# EAGLE design 0_96_OLED_FOR_1U (EAGLE 9.5.0)
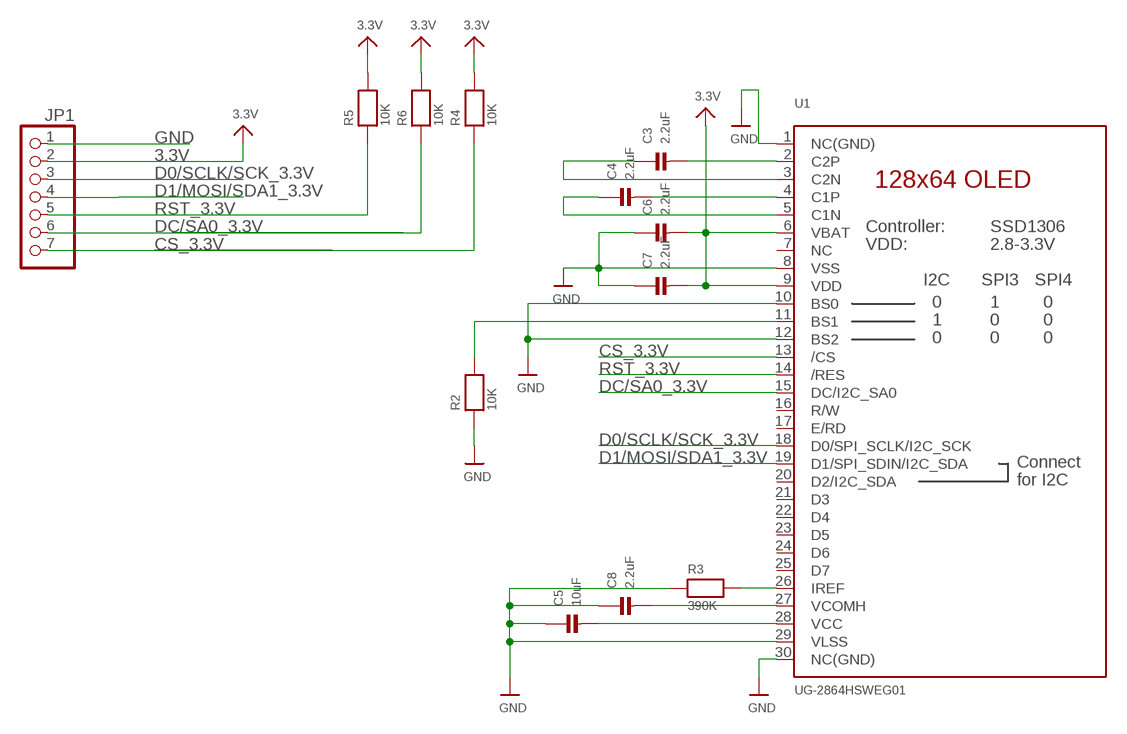
[diagram p0: schematic, sheet 1]

## Parts
C3  2.2uF  CAP_CERAMIC0603MINI  [0603-MINI]
C4  2.2uF  CAP_CERAMIC0603MINI  [0603-MINI]
C5  10uF  CAP_CERAMIC0603MINI  [0603-MINI]
C6  2.2uF  CAP_CERAMIC0603MINI  [0603-MINI]
C7  2.2uF  CAP_CERAMIC0603MINI  [0603-MINI]
C8  2.2uF  CAP_CERAMIC0603MINI  [0603-MINI]
JP1  HEADER-1X7ROUND  [1X07_ROUND]
R2  10K  RESISTOR0603MINI  [0603-MINI]
R3  390K  RESISTOR0603MINI  [0603-MINI]
R4  10K  RESISTOR0603MINI  [0603-MINI]
R5  10K  RESISTOR0603MINI  [0603-MINI]
R6  10K  RESISTOR0603MINI  [0603-MINI]
U1  UG-2864HSWEG01  MICROBUILDER_DISP_OLED_UG-2864HSWEG010.96"  [MICROBUILDER_UG-2864HSWEG01_0.96IN_WRAPAROUND]

## Nets
3.3V: C6.2 C7.2 JP1.2 R4.2 R5.2 R6.2 U1.6(VBAT) U1.9(VDD)
CS_3.3V: JP1.7 R4.1 U1.13(/CS)
D0/SCLK/SCK_3.3V: JP1.3 U1.18(D0/SPI_SCLK/I2C_SCK)
D1/MOSI/SDA1_3.3V: JP1.4 U1.19(D1/SPI_SDIN/I2C_SDA)
DC/SA0_3.3V: JP1.6 R6.1 U1.15(DC/I2C_SA0)
GND: C5.1 C6.1 C7.1 C8.1 JP1.1 R2.1 R3.1 U1.1(NC(GND)) U1.8(VSS) U1.10(BS0) U1.12(BS2) U1.29(VLSS) U1.30(NC(GND))
N$1: R2.2 U1.11(BS1)
N$3: R3.2 U1.26(IREF)
N$4: C3.2 U1.2(C2P)
N$5: C3.1 U1.3(C2N)
N$6: C4.2 U1.4(C1P)
N$7: C4.1 U1.5(C1N)
N$11: C5.2 U1.28(VCC)
N$12: C8.2 U1.27(VCOMH)
RST_3.3V: JP1.5 R5.1 U1.14(/RES)
Unconnected: U1.7(NC) U1.16(R/W) U1.17(E/RD) U1.20(D2/I2C_SDA) U1.21(D3) U1.22(D4) U1.23(D5) U1.24(D6) U1.25(D7)

## Library data of the parts
C3-C8 = microbuilder:CAP_CERAMIC: Ceramic Capacitors 0402 - 0402 Surface Mount Capacitors 16pF 50V 5% [Digikey: 445-4899-2-ND] 18pF 50V 5% [Digikey: 490-1281-2-ND] 22pF 50V 5% [Digikey: 490-1283-2-ND] 68pF 50V 5% [Digikey: 490-1289-2-ND] 0.1uF 10V 10% [Digikey: 490-1318-2-ND] 1.0uF 6.3V 10% [Digikey: 490-1320-2-ND] 0603 - 0603 Surface Mount Capacitors 16 pF 50V 5% [Digikey: 445-5051-2-ND] 22 pF 50V [Digikey: PCC220ACVTR-ND] 33 pF 50V 5% [Digikey: 490-1415-1-ND] 56pF 50V 5% [Digikey: 490-1421-1-ND] 220pF 50V 5% [Digikey: 445-1285-1-ND] 680 pF 50V 2200 pF 50V 5% C0G [Digikey: 445-1297-1-ND] 5600 pF 100V 5% X7R [Digikey: 478-3711-1-ND] 0.1 µF 25V 10% [Digikey: PCC2277TR-ND] 0.22 µF 16V 10% X7R [Digikey: 445-1318-1-ND] 1.0 µF 25V 10% [Digikey: 445-5146-2-ND] 0603 - RF Specific 3pF 250V +/-0.1pF RF [Digikey: 712-1347-1-ND] 18 pF 250V 5% [Digikey: 478-3505-1-ND or 712-1322-1-ND] 56 pF 250V 5% C0G RF [Digikey: 490-4867-1-ND] 68 pF 250V RF [Digikey: 490-4868-1-ND] 0805 - 0805 Surface Mount Capacitors 220 pF 250V 2% RF Ceramic Capacitor [Digikey: 712-1398-1-ND] 1000 pF 50V 2% NP0 Ceramic Capacitor [Digikey: 478-3760-1-ND] 0.1 µF 25V 10% Ceramic Capacitor [Digikey: PCC1828TR-ND] 1.0 µF 16V 10% Ceramic Capacitor[Digikey: 490-1691-2-ND] 10.0 µF 10V 10% Ceramic Capacitor[Digikey: 709-1228-1-ND] 10.0 uF 16V 10% Ceramic Capacitor [Digikey: 478-5165-2-ND] 47 uF 6.3V 20% Ceramic Capacitor [Digikey: 587-1779-1-ND or 399-5506-1-ND] 1206 - 1206 Surface Mount Capacitors 47uF 10V 20% Ceramic Capacitor [Digikey: 490-5528-1-ND or 399-5508-1-ND or 445-6010-1-ND] 100uF 6.3V -20%, +80% Y5V Ceramic Capacitor (Digikey: 490-4512-1-ND, Mouser: 81-GRM31CF50J107ZE1L)
JP1 = microbuilder:HEADER-1X7: PIN HEADER; SPICEPREFIX: X
R2-R6 = microbuilder:RESISTOR: Resistors 0402 - 0402 Surface Mount Package 22 Ohm 1% 1/16W [Digikey: 311-22.0LRTR-ND] 33 Ohm 5% 1/16W 1.0K 5% 1/16W 1.5K 5% 1/16W 2.0K 1% 1/16W 10.0K 1% 1/16W [Digikey: 311-10.0KLRTR-ND] 10.0K 5% 1/16W [Digikey: RMCF0402JT10K0TR-ND] 12.1K 1% 1/16W [Digikey: 311-22.0LRTR-ND] 100.0K 5% 1/16W 0603 - 0603 Surface Mount Package 0 Ohm 1/10 Watt 1% Resistor 15 Ohm 1/10 Watt 1% Resistor 33 Ohm 1/10 Watt 1% Resistor 49.9 Ohm 1/10 Watt 1% Resistor 100 Ohm 1/10 Watt 1% Resistor 150 Ohm 1/10 Watt 1% Resistor 240 Ohm 1/10 Watt 1% Resistor 390 Ohm 1/10 Watt 1% Resistor 560 Ohm 1/10 Watt 1% Resistor 680 Ohm 1/10 Watt 1% Resistor 750 Ohm 1/10 Watt 1% Resistor 1.0K Ohm 1/10 Watt 1% Resistor 1.5K Ohm 1/10 Watt 1% Resistor 2.0K Ohm 1/10 Watt 1% Resistor 2.2K Ohm 1/10 Watt 1% Resistor 3.3K Ohm 1/10 Watt 1% Resistor 4.7K Ohm 1/10 Watt 1% Resistor 10.0K Ohm 1/10 Watt 1% Resistor 12.0K Ohm 1/10 Watt 1% Resistor 12.1K Ohm 1/10 Watt 1% Resistor 20.0K Ohm 1/10 Watt 1% Resistor 33.0K Ohm 1/10 Watt 1% Resistor 100.0K Ohm 1/10 Watt 1% Resistor 0805 - 0805 Surface Mount Package 0 Ohm 1/8 Watt 1% Resistor 33 Ohm 1/8 Watt 1% Resistor 100 Ohm 1/8 Watt 1% Resistor 150 Ohm 1/8 Watt 1% Resistor 200 Ohm 1/8 Watt 1% Resistor 240 Ohm 1/8 Watt 1% Resistor 330 Ohm 1/8 Watt 1% Resistor 390 Ohm 1/8 Watt 1% Resistor 470 Ohm 1/8 Watt 1% Resistor 1.0K Ohm 1/8 Watt 1% Resistor 1.5K Ohm 1/8 Watt 1% Resistor 2.0K Ohm 1/8 Watt 1% Resistor 4.7K Ohm 1/8 Watt 1% Resistor 5.1K Ohm 1/8 Watt 1% Resistor 5.6K Ohm 1/8 Watt 1% Resistor 10.0K Ohm 1/8 Watt 1% Resistor 22.0K Ohm 1/8 Watt 1% Resistor 33.0K Ohm 1/8 Watt 1% Resistor 100K Ohm 1/8 Watt 1% Resistor 1206 - 1206 Surface Mount Package 2012 - 2010 Surface Mount Package 0.11 Ohm 1/2 Watt 1% Resistor - Digikey: RHM.11UCT-ND
U1 = 0_96_OLED_FOR_1U:MICROBUILDER_DISP_OLED_UG-2864HSWEG01: UG-2864HSWEG01 OLED display Both 1.3" and 0.96" models share the same FPC tab footprint, only the screen dimensions vary.

## Board
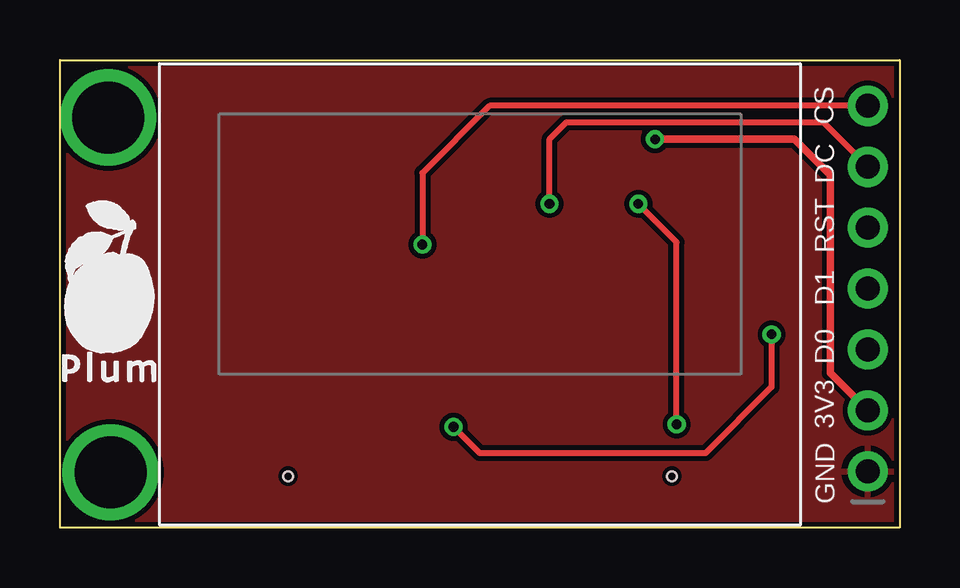
[diagram p1: board, top side]
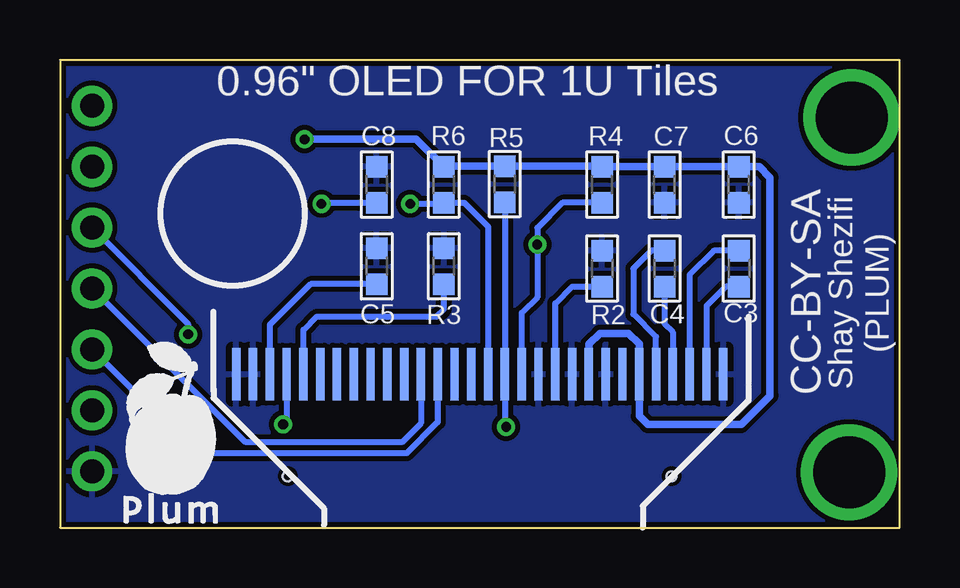
[diagram p2: board, bottom side, seen from below]

Size 35 x 19.5 mm. Coordinates in mm from the lower left corner, seen from the top.
Outline: 0,0 0,19.5 35,19.5 35,0 0,0
Copper layers (1*16): Top 0.0356mm / dielectric 1.5011mm / Bottom 0.0356mm
Design rules "LaenPCBOrder *": minimum track width 6mil, minimum drill 13mil, track to track 8mil, track to pad 8mil, pad to pad 8mil, via to via 8mil, smd to smd 8mil, copper to edge 8mil, drill to drill 8mil, minimum pad ring 7mil, minimum via ring 7mil, stop-mask expansion 3mil, vias tented up to drill 25mil, thermal gap 10mil

### Footprints (pad centres in the part's own frame; a part is rotated, then mirrored left to right if it is on the bottom)
0603-MINI = smd 0.9 x 0.9: 1 -0.75,0; 2 0.75,0
1X07_ROUND = drill 1 pad 1.676: 1 -7.62,0; 2 -5.08,0; 3 -2.54,0; 4 0,0; 5 2.54,0; 6 5.08,0; 7 7.62,0
MICROBUILDER_UG-2864HSWEG01_0.96IN_WRAPAROUND = smd 0.35 x 2.2 bottom: 1 -10.15,-1.2; 2 -9.45,-1.2; 3 -8.75,-1.2; 4 -8.05,-1.2; 5 -7.35,-1.2; 6 -6.65,-1.2; 7 -5.95,-1.2; 8 -5.25,-1.2; 9 -4.55,-1.2; 10 -3.85,-1.2; 11 -3.15,-1.2; 12 -2.45,-1.2; 13 -1.75,-1.2; 14 -1.05,-1.2; 15 -0.35,-1.2; 16 0.35,-1.2; 17 1.05,-1.2; 18 1.75,-1.2; 19 2.45,-1.2; 20 3.15,-1.2; 21 3.85,-1.2; 22 4.55,-1.2; 23 5.25,-1.2; 24 5.95,-1.2; 25 6.65,-1.2; 26 7.35,-1.2; 27 8.05,-1.2; 28 8.75,-1.2; 29 9.45,-1.2; 30 10.15,-1.2 | hole 0.4: -8,-5.45; 8,-5.45

### Placement (x,y rotation side)
C3  6.7,10.8 270 bottom
C4  9.8,10.8 270 bottom
C5  21.8,10.9 270 bottom
C6  6.7,14.3 90 bottom
C7  9.8,14.3 90 bottom
C8  21.8,14.3 270 bottom
JP1  33.67,9.97 90 top
R2  12.4,10.8 270 bottom
R3  19,10.9 270 bottom
R4  12.4,14.3 90 bottom
R5  16.46,14.32 90 bottom
R6  19,14.3 90 bottom
U1  17.5,7.59 0 top

### Tracks (layer width: path | path; a pad name or v marks a point on that pad's centre or on a via)
3.3V  (via drill 0.4)
  Top 0.305: v24.8,16.19 30.61,16.19 32.1,14.7 32.1,6.45 JP1.2
  Bottom 0.305: U1.9 12.95,7.65 12.5,8.1 11.3,8.1 10.85,7.65 U1.6 10.85,4.65 10.5,4.3 6.6,4.3 5.4,5.5 5.4,14.6 5.85,15.05 C6.2 C7.2 R4.2 12.42,15.07 R5.2 18.98,15.07 R6.2 20.15,16.2 v24.79,16.2 v24.8,16.19
CS_3.3V  (via drill 0.4)
  Top 0.254: JP1.7 17.9,17.59 15.1,14.79 v15.1,11.8
  Bottom 0.254: U1.13 15.75,8.95 15.1,9.6 v15.1,11.8 15.1,12.5 14.05,13.55 R4.1
D0/SCLK/SCK_3.3V
  Bottom 0.254: JP1.3 29.34,3.1 20.55,3.1 19.25,4.4 U1.18
D1/MOSI/SDA1_3.3V
  Bottom 0.254: JP1.4 27.26,3.56 20.74,3.56 19.95,4.35 U1.19 20,6.34
DC/SA0_3.3V  (via drill 0.4)
  Top 0.254: JP1.6 31.81,16.9 21.1,16.9 20.4,16.2 v20.4,13.5
  Bottom 0.254: v20.4,13.5 19.1,13.5 19.05,13.55 R6.1 18.15,13.55 17.15,12.55 U1.15
GND
  pour Top: 35,19.5 0,19.5 0,0 35,0
  pour Bottom: 35,19.5 0,19.5 0,0 35,0
N$1
  Bottom 0.254: U1.11 14.35,8.1 | 14.35,8.1 | R2.2 13.65,10.05 14.35,9.35 14.35,8.1
N$2  (via drill 3)
  other vias: 2.1,2.3
N$3
  Bottom 0.254: R3.2 19,9.1 19.3,8.8 24.3,8.8 24.85,8.25 U1.26
N$4
  Bottom 0.254: U1.2 8.05,9.25 7.25,10.05 C3.2
N$5
  Bottom 0.254: U1.3 8.75,10.55 7.75,11.55 C3.1
N$6
  Bottom 0.254: C4.2 9.8,8.5 9.45,8.15 U1.4
N$7
  Bottom 0.254: U1.5 10.15,7.95 11.1,8.9 11.1,10.8 10.35,11.55 C4.1
N$8  (via drill 3)
  other vias: 2,17.1
N$11
  Bottom 0.254: U1.28 26.25,8.45 24.55,10.15 C5.2
N$12  (via drill 0.4)
  Top 0.254: v25.7,4.3 25.7,11.9 v24.1,13.5
  Bottom 0.254: U1.27 25.55,4.45 v25.7,4.3 | v24.1,13.5 24.05,13.55 C8.2
RST_3.3V  (via drill 0.4)
  Top 0.254: v29.66,8.06 29.66,5.86 26.9,3.1 17.5,3.1 v16.4,4.2
  Bottom 0.254: JP1.5 29.66,8.5 v29.66,8.06 | v16.4,4.2 16.45,4.25 U1.14 R5.1

### Text on the board
tPlace: CS | DC | RST | D1 | D0 | 3V3 | GND
bPlace: 0.96" OLED FOR 1U Tiles | Shay Shezifi / (PLUM) | CC-BY-SA